# Altium schematic sheet CoreCtrl.SchDoc: ODRIVE-FOC
size A3; Author: SEASKY; DocumentNumber: SEASKY; Revision: V1.1; SheetNumber: 1; SheetTotal: 4; Application_BuildNumber: 0
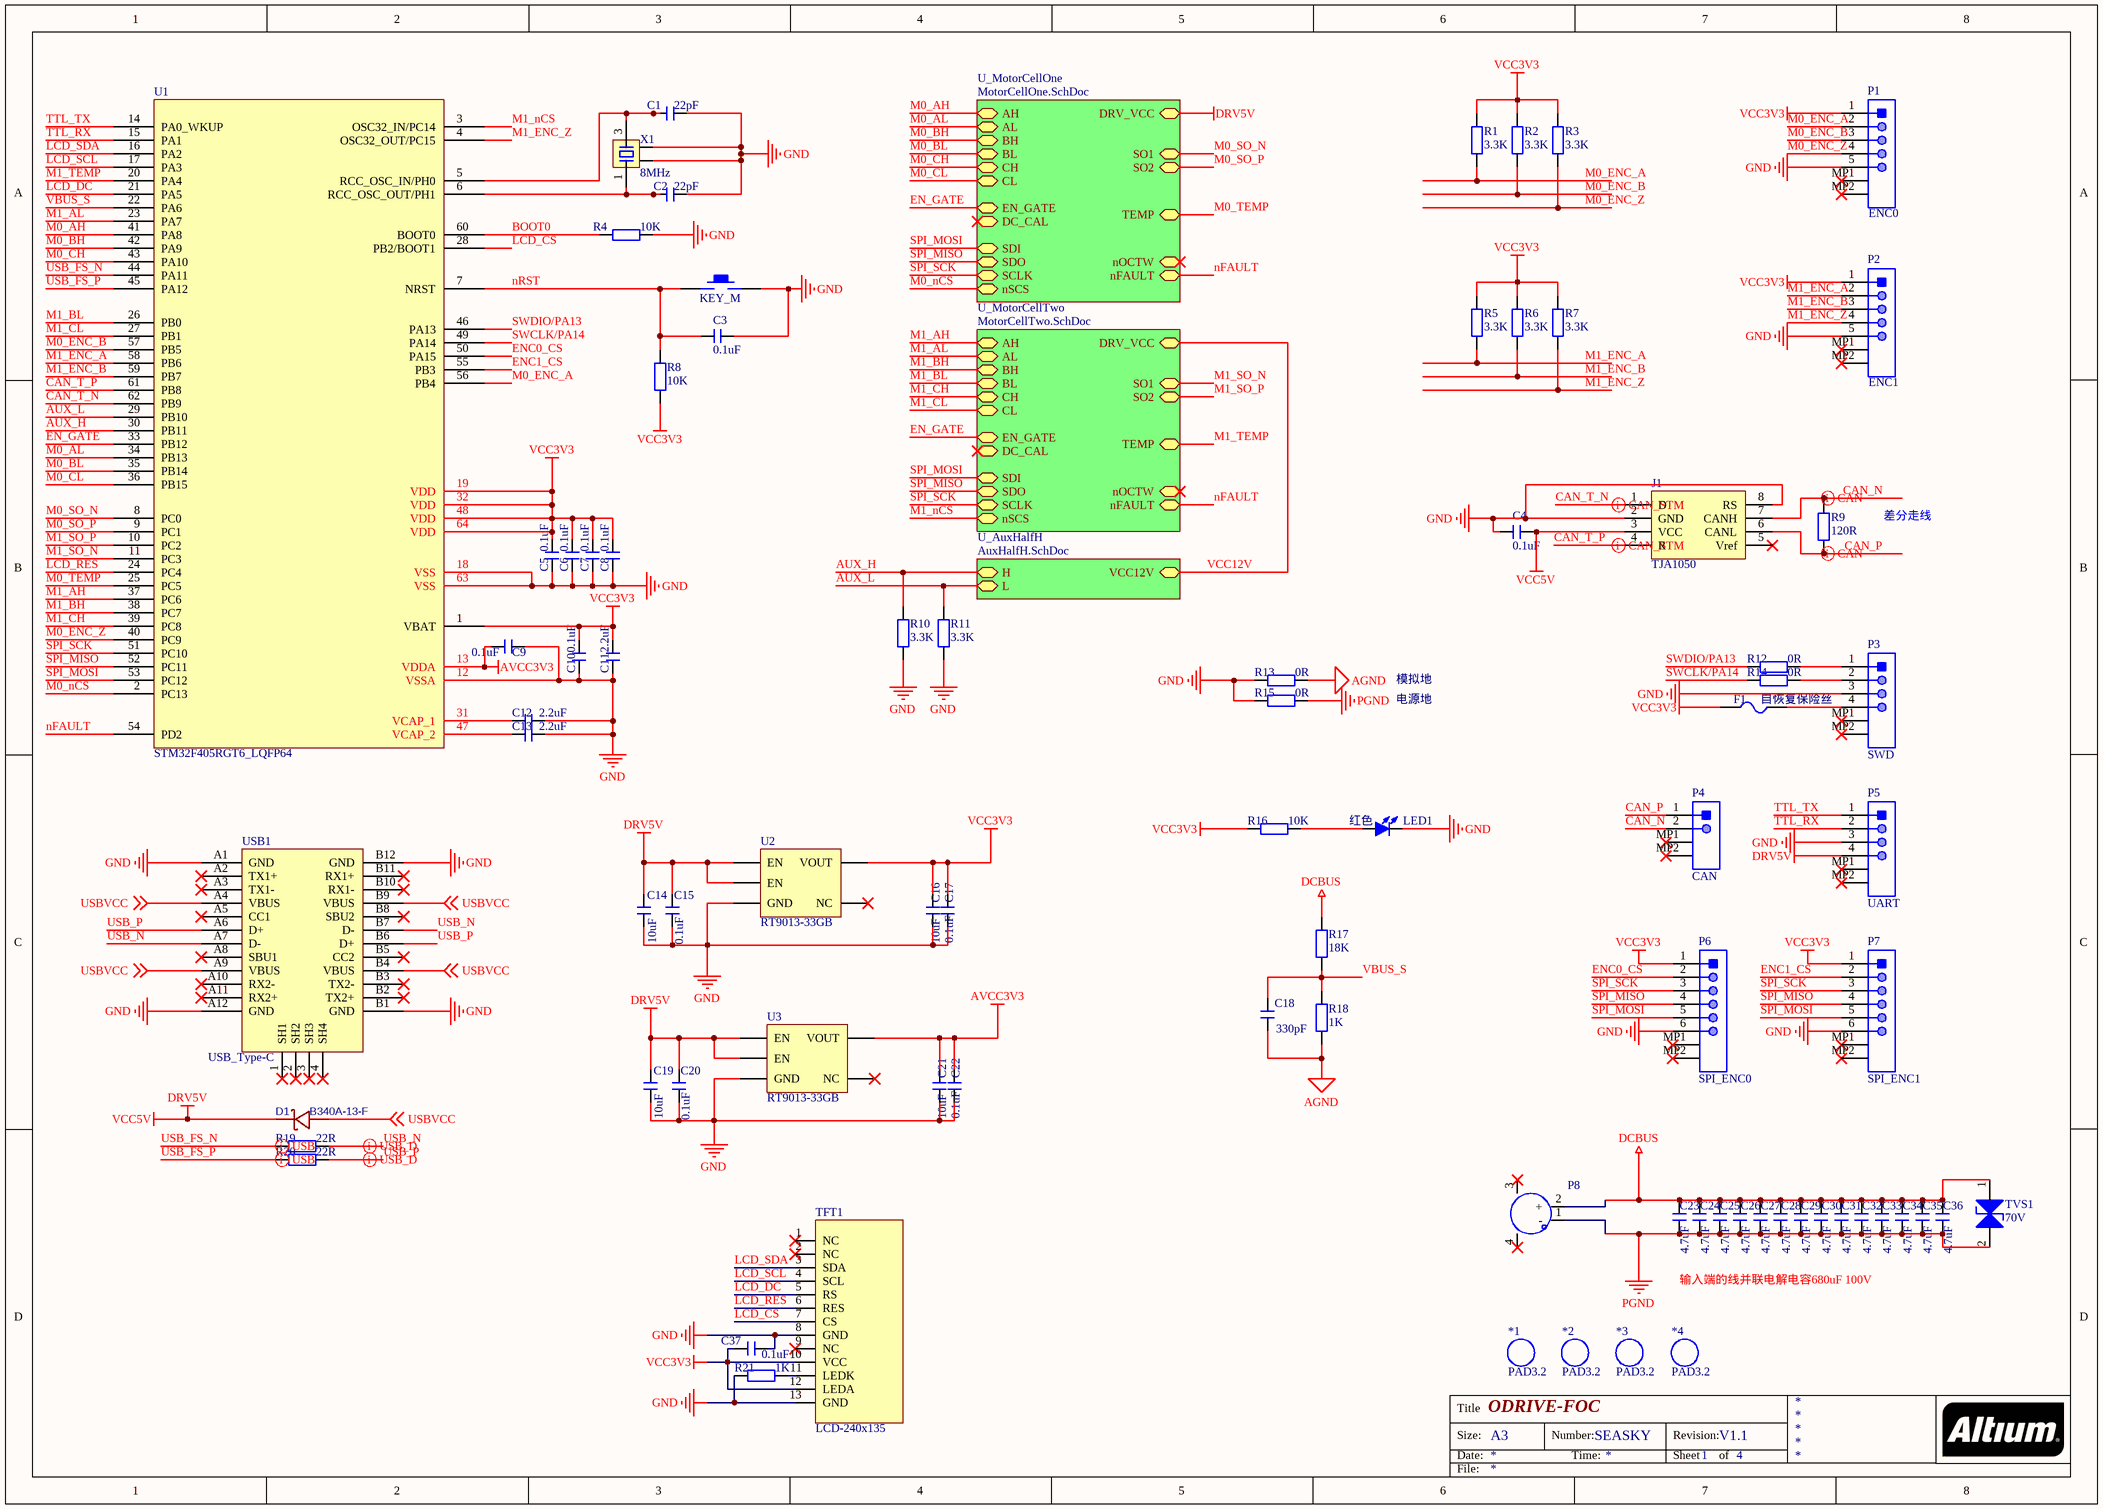
[diagram p0: CoreCtrl.SchDoc]

## Parts
*1  PAD3.2  [PAD3.2]
*2  PAD3.2  [PAD3.2]
*3  PAD3.2  [PAD3.2]
*4  PAD3.2  [PAD3.2]
C1  22pF  [C 0603_L]
C2  22pF  [C 0603_L]
C3  0.1uF  [C 0603_L]
C4  0.1uF  [C 0603_L]
C5  0.1uF  [C 0603_L]
C6  0.1uF  [C 0603_L]
C7  0.1uF  [C 0603_L]
C8  0.1uF  [C 0603_L]
C9  0.1uF  [C 0603_L]
C10  0.1uF  [C 0603_L]
C11  2.2uF  [C 0603_L]
C12  2.2uF  [C 0603_L]
C13  2.2uF  [C 0603_L]
C14  10uF  [C 0805_L]
C15  0.1uF  [C 0805_L]
C16  10uF  [C 0805_L]
C17  0.1uF  [C 0805_L]
C18  330pF  [C 0603_L]
C19  10uF  [C 0805_L]
C20  0.1uF  [C 0805_L]
C21  10uF  [C 0805_L]
C22  0.1uF  [C 0805_L]
C23  4.7uF  [C 1210_L]
C24  4.7uF  [C 1210_L]
C25  4.7uF  [C 1210_L]
C26  4.7uF  [C 1210_L]
C27  4.7uF  [C 1210_L]
C28  4.7uF  [C 1210_L]
C29  4.7uF  [C 1210_L]
C30  4.7uF  [C 1210_L]
C31  4.7uF  [C 1210_L]
C32  4.7uF  [C 1210_L]
C33  4.7uF  [C 1210_L]
C34  4.7uF  [C 1210_L]
C35  4.7uF  [C 1210_L]
C36  4.7uF  [C 1210_L]
C37  0.1uF  [C 0603_L]
D1  B340A-13-F  [SMA_L4.4-W2.6-LS5.0-RD]
F1  自恢复保险丝  [FU 0603]
J1  TJA1050  [SOIC-8_150mil]
LED1  红色  [LED 0805G]
P1  ENC0  [JST-SM05B-GHS-TB_V]
P2  ENC1  [JST-SM05B-GHS-TB_V]
P3  SWD  [JST-SM04B-GHS-TB_V]
P4  CAN  [CONN-SMD_SM02B-GHS-TB-LF-SN]
P5  UART  [JST-SM04B-GHS-TB_V]
P6  SPI_ENC0  [JST-BM06B-GHS-TBT_V]
P7  SPI_ENC1  [JST-BM06B-GHS-TBT_V]
P8  XT60PW  [XT60PW]  (value not drawn)
R1  3.3K  [R 0603_L]
R2  3.3K  [R 0603_L]
R3  3.3K  [R 0603_L]
R4  10K  [R 0603_L]
R5  3.3K  [R 0603_L]
R6  3.3K  [R 0603_L]
R7  3.3K  [R 0603_L]
R8  10K  [R 0603_L]
R9  120R  [R 0603_L]
R10  3.3K  [R 0603_L]
R11  3.3K  [R 0603_L]
R12  0R  [R 0603_L]
R13  0R  [R 0603_L]
R14  0R  [R 0603_L]
R15  0R  [R 0603_L]
R16  10K  [R 0603_L]
R17  18K  [R 0603_L]
R18  1K  [R 0603_L]
R19  22R  [R 0603_L]
R20  22R  [R 0603_L]
R21  1K  [R 0603_L]
RST1  KEY_M  [SMD-3.2*4.2]
TFT1  LCD-240x135  [LCD-240x135]
TVS1  70V  [SMA(DO-214AC)]
U1  STM32F405RGT6_LQFP64  [LQFP-64_10X10X05P]
U2  RT9013-33GB  [SOT23-5M]
U3  RT9013-33GB  [SOT23-5M]
USB1  USB_Type-C  [Type-C-TOP]
X1  8MHz  [OSC 3225-4P]

## Sub-sheets
U_AuxHalfH = AuxHalfH.SchDoc: L (bidir), H (bidir), VCC12V (bidir)
U_MotorCellOne = MotorCellOne.SchDoc: EN_GATE (bidir), AH (bidir), nSCS (bidir), BL (bidir), DC_CAL (bidir), SDI (bidir), SCLK (bidir), nOCTW (bidir), SDO (bidir), BH (bidir), nFAULT (bidir), SO2 (bidir), CL (bidir), CH (bidir), SO1 (bidir), AL (bidir), TEMP (bidir), DRV_VCC (bidir)
U_MotorCellTwo = MotorCellTwo.SchDoc: nSCS (bidir), nOCTW (bidir), SCLK (bidir), AH (bidir), nFAULT (bidir), SDI (bidir), TEMP (bidir), SO1 (bidir), SO2 (bidir), AL (bidir), BL (bidir), SDO (bidir), CL (bidir), BH (bidir), DC_CAL (bidir), EN_GATE (bidir), CH (bidir), DRV_VCC (bidir)

## Nets
AGND: C18.2 R13.1 R18.2
AVCC3V3: C9.2 C21.2 C22.2 U1.13(VDDA) U3.5(VOUT)
DCBUS: C23.2 C24.2 C25.2 C26.2 C27.2 C28.2 C29.2 C30.2 C31.2 C32.2 C33.2 C34.2 C35.2 C36.2 P8.2(+) R17.1 TVS1.1
DRV5V: C4.1 C14.2 C15.2 C19.2 C20.2 D1.1(K) J1.3(VCC) P5.4 U2.1(EN) U2.3(EN) U3.1(EN) U3.3(EN) ; sheet U_MotorCellOne/DRV_VCC  [also labelled VCC5V]
GND: C1.2 C2.2 C3.1 C4.2 C5.1 C6.1 C7.1 C8.1 C9.1 C10.1 C11.1 C12.2 C13.2 C14.1 C15.1 C16.1 C17.1 C19.1 C20.1 C21.1 C22.1 C37.1 J1.2(GND) J1.8(RS) LED1.2(K) P1.5 P2.5 P3.3 P5.3 P6.6 P7.6 R4.1 R10.2 R11.2 R13.2 R15.2 R21.1 RST1.2 TFT1.8(GND) TFT1.13(GND) U1.12(VSSA) U1.18(VSS) U1.63(VSS) U2.2(GND) U3.2(GND) USB1.A1(GND) USB1.A12(GND) USB1.B1(GND) USB1.B12(GND) X1.2 X1.4
PGND: C23.1 C24.1 C25.1 C26.1 C27.1 C28.1 C29.1 C30.1 C31.1 C32.1 C33.1 C34.1 C35.1 C36.1 P8.1(-) R15.1 TVS1.2
VCC3V3: C5.2 C6.2 C7.2 C8.2 C10.2 C11.2 C16.2 C17.2 C37.2 F1.2 P1.1 P2.1 P6.1 P7.1 R1.1 R2.1 R3.1 R5.1 R6.1 R7.1 R8.1 R16.1 TFT1.10(VCC) TFT1.12(LEDA) U1.1(VBAT) U1.19(VDD) U1.32(VDD) U1.48(VDD) U1.64(VDD) U2.5(VOUT)
AUX_H: R10.1 U1.30(PB11) ; sheet U_AuxHalfH/H
AUX_L: R11.1 U1.29(PB10) ; sheet U_AuxHalfH/L
BOOT0: R4.2 U1.60(BOOT0)
CAN_N: J1.7(CANH) P4.2 R9.1
CAN_P: J1.6(CANL) P4.1 R9.2
CAN_T_N: J1.1(D) U1.62(PB9)
CAN_T_P: J1.4(R) U1.61(PB8)
EN_GATE: U1.33(PB12) ; sheet U_MotorCellOne/EN_GATE, sheet U_MotorCellTwo/EN_GATE
ENC0_CS: P6.2 U1.50(PA15)
ENC1_CS: P7.2 U1.55(PB3)
LCD_CS: TFT1.7(CS) U1.28(PB2/BOOT1)
LCD_DC: TFT1.5(RS) U1.21(PA5)
LCD_RES: TFT1.6(RES) U1.24(PC4)
LCD_SCL: TFT1.4(SCL) U1.17(PA3)
LCD_SDA: TFT1.3(SDA) U1.16(PA2)
M0_AH: U1.41(PA8) ; sheet U_MotorCellOne/AH
M0_AL: U1.34(PB13) ; sheet U_MotorCellOne/AL
M0_BH: U1.42(PA9) ; sheet U_MotorCellOne/BH
M0_BL: U1.35(PB14) ; sheet U_MotorCellOne/BL
M0_CH: U1.43(PA10) ; sheet U_MotorCellOne/CH
M0_CL: U1.36(PB15) ; sheet U_MotorCellOne/CL
M0_ENC_A: P1.2 R1.2 U1.56(PB4)
M0_ENC_B: P1.3 R2.2 U1.57(PB5)
M0_ENC_Z: P1.4 R3.2 U1.40(PC9)
M0_nCS: U1.2(PC13) ; sheet U_MotorCellOne/nSCS
M0_SO_N: U1.8(PC0) ; sheet U_MotorCellOne/SO1
M0_SO_P: U1.9(PC1) ; sheet U_MotorCellOne/SO2
M0_TEMP: U1.25(PC5) ; sheet U_MotorCellOne/TEMP
M1_AH: U1.37(PC6) ; sheet U_MotorCellTwo/AH
M1_AL: U1.23(PA7) ; sheet U_MotorCellTwo/AL
M1_BH: U1.38(PC7) ; sheet U_MotorCellTwo/BH
M1_BL: U1.26(PB0) ; sheet U_MotorCellTwo/BL
M1_CH: U1.39(PC8) ; sheet U_MotorCellTwo/CH
M1_CL: U1.27(PB1) ; sheet U_MotorCellTwo/CL
M1_ENC_A: P2.2 R5.2 U1.58(PB6)
M1_ENC_B: P2.3 R6.2 U1.59(PB7)
M1_ENC_Z: P2.4 R7.2 U1.4(OSC32_OUT/PC15)
M1_nCS: U1.3(OSC32_IN/PC14) ; sheet U_MotorCellTwo/nSCS
M1_SO_N: U1.11(PC3) ; sheet U_MotorCellTwo/SO1
M1_SO_P: U1.10(PC2) ; sheet U_MotorCellTwo/SO2
M1_TEMP: U1.20(PA4) ; sheet U_MotorCellTwo/TEMP
nFAULT: U1.54(PD2) ; sheet U_MotorCellOne/nFAULT, sheet U_MotorCellTwo/nFAULT
nRST: C3.2 R8.2 RST1.1 U1.7(NRST)
SPI_MISO: P6.4 P7.4 U1.52(PC11) ; sheet U_MotorCellOne/SDO, sheet U_MotorCellTwo/SDO
SPI_MOSI: P6.5 P7.5 U1.53(PC12) ; sheet U_MotorCellOne/SDI, sheet U_MotorCellTwo/SDI
SPI_SCK: P6.3 P7.3 U1.51(PC10) ; sheet U_MotorCellOne/SCLK, sheet U_MotorCellTwo/SCLK
SWCLK/PA14: R14.2 U1.49(PA14)
SWDIO/PA13: R12.2 U1.46(PA13)
TTL_RX: P5.2 U1.15(PA1)
TTL_TX: P5.1 U1.14(PA0_WKUP)
USB_FS_N: R19.1 U1.44(PA11)
USB_FS_P: R20.1 U1.45(PA12)
USB_N: R19.2 USB1.A7(D-) USB1.B7(D-)
USB_P: R20.2 USB1.A6(D+) USB1.B6(D+)
USBVCC: D1.2(A) USB1.A4(VBUS) USB1.A9(VBUS) USB1.B4(VBUS) USB1.B9(VBUS) ; off-sheet USBVCC
VBUS_S: C18.1 R17.2 R18.1 U1.22(PA6)
VCC12V: sheet U_AuxHalfH/VCC12V, sheet U_MotorCellTwo/DRV_VCC
NetC1_1: C1.1 U1.5(RCC_OSC_IN/PH0) X1.3
NetC2_1: C2.1 U1.6(RCC_OSC_OUT/PH1) X1.1
NetC12_1: C12.1 U1.31(VCAP_1)
NetC13_1: C13.1 U1.47(VCAP_2)
NetF1_1: F1.1 P3.4
NetLED1_1: LED1.1(A) R16.2
NetP3_1: P3.1 R12.1
NetP3_2: P3.2 R14.1
NetR21_2: R21.2 TFT1.11(LEDK)

Not connected (* = marked no-connect by the designer): J1 5(Vref)*; P1 MP1* MP2*; P2 MP1* MP2*; P3 MP1* MP2*; P4 MP1(3)* MP2*; P5 MP1* MP2*; P6 MP1* MP2*; P7 MP1* MP2*; P8 3* 4*; TFT1 1(NC)* 2(NC)* 9(NC)*; U2 4(NC)*; U3 4(NC)*; USB1 1(SH1)* 2(SH2)* 3(SH3)* 4(SH4)* A2(TX1+)* A3(TX1-)* A5(CC1)* A8(SBU1)* A10(RX2-)* A11(RX2+)* B2(TX2+)* B3(TX2-)* B5(CC2)* B8(SBU2)* B10(RX1-)* B11(RX1+)*

## Layout directives
differential pair: CAN_N, CAN_P, CAN_T_N, CAN_T_P, USB_FS_N, USB_FS_P, USB_N, USB_P

## Notes on the sheet
- 差分走线
- 模拟地
- 电源地
- 输入端的线并联电解电容680uF 100V
- Title
- Size:
- Date:
- A3
- Number:
- Time:
- Revision:
- Sheet
- of
- File:

## Library data of the parts
C1-C37 = C: 贴片电容
D1 = B340A-13-F: BOM_Manufacturer: DIODES; SMT Type: Extend; BOM_Supplier: LCSC; BOM_Manufacturer Part: B340A-13-F; BOM_Supplier Part: C85098; BOM_JLCPCB SMD: Yes; spicePre: D; spiceSymbolName: B340A-13-F
F1 = FU: 贴片保险丝
J1 = TJA1050: CAN芯片
LED1 = LED-SMD: 贴片LED
P1 P2 = SM05B-GHS-TB(LF)(SN): GH Disconnectable Crimp Style Connector, Pitch 1.25 mm, 1 x 5 Position, Height 4.25 mm, -25 to 85 degC, RoHS, Tape and Reel; Manufacturer: JST; No of Positions: 5; Pitch: 1.25mm; Style/Orientation: RightAngleHeader/Plug; Package Reference: SM05B-GHS-TB; Type: WiretoBoard; Datasheet URL: http://www.jst-mfg.com/product/pdf/eng/eGH.pdf; Termination: Crimp; Manufacturer URL: http://www.jst.com/home2.html; Mounting Technology: SurfaceMount; Datasheet Version: 05/2016; Package Description: GH Disconnectable Crimp Style Connector, Pitch 1.25 mm, 1 x 5 Position, Height 4.25 mm
P3 P5 = SM04B-GHS-TB(LF)(SN): GH Disconnectable Crimp Style Connector, Pitch 1.25 mm, 1 x 4 Position, Height 4.25 mm, -25 to 85 degC, RoHS, Tape and Reel; Manufacturer: JST; No of Positions: 4; Pitch: 1.25mm; Style/Orientation: RightAngleHeader/Plug; Package Reference: SM04B-GHS-TB; Type: WiretoBoard; Datasheet URL: http://www.jst-mfg.com/product/pdf/eng/eGH.pdf; Termination: Crimp; Manufacturer URL: http://www.jst.com/home2.html; Mounting Technology: SurfaceMount; Datasheet Version: 05/2016; Package Description: GH Disconnectable Crimp Style Connector, Pitch 1.25 mm, 1 x 4 Position, Height 4.25 mm
P4 = SM02B-GHS-TB(LF)(SN)
P6 = SM06B-GHS-TB(LF)(SN): GH Disconnectable Crimp Style Connector, Pitch 1.25 mm, 1 x 6 Position, Height 4.25 mm, -25 to 85 degC, RoHS, Tape and Reel; Manufacturer: JST; No of Positions: 6; Pitch: 1.25mm; Style/Orientation: RightAngleHeader/Plug; Package Reference: SM06B-GHS-TB; Type: WiretoBoard; Datasheet URL: http://www.jst-mfg.com/product/pdf/eng/eGH.pdf; Termination: Crimp; Manufacturer URL: http://www.jst.com/home2.html; Mounting Technology: SurfaceMount; Datasheet Version: 05/2016; Package Description: GH Disconnectable Crimp Style Connector, Pitch 1.25 mm, 1 x 6 Position, Height 4.25 mm
P7 = BM06B-GHS-TBT(LF)(SN): GH Disconnectable Crimp Style Connector, Pitch 1.25 mm, 1 x 6 Position, Height 4.05 mm, -25 to 85 degC, RoHS, Tape and Reel; Manufacturer: JST; No of Positions: 6; Pitch: 1.25mm; Style/Orientation: StraightHeader/Plug; Package Reference: BM06B-GHS-TBT; Type: WiretoBoard; Datasheet URL: http://www.jst-mfg.com/product/pdf/eng/eGH.pdf; Termination: Crimp; Manufacturer URL: http://www.jst.com/home2.html; Mounting Technology: SurfaceMount; Datasheet Version: 05/2016; Package Description: GH Disconnectable Crimp Style Connector, Pitch 1.25 mm, 1 x 6 Position, Height 4.05 mm
R1-R21 = R: 贴片电阻
TVS1 = SMAJ28CA
X1 = XTAL-4P: 4脚无源晶振